# Altium schematic sheet Analog.SchDoc
size A4; SheetNumber: 2; SheetTotal: 7
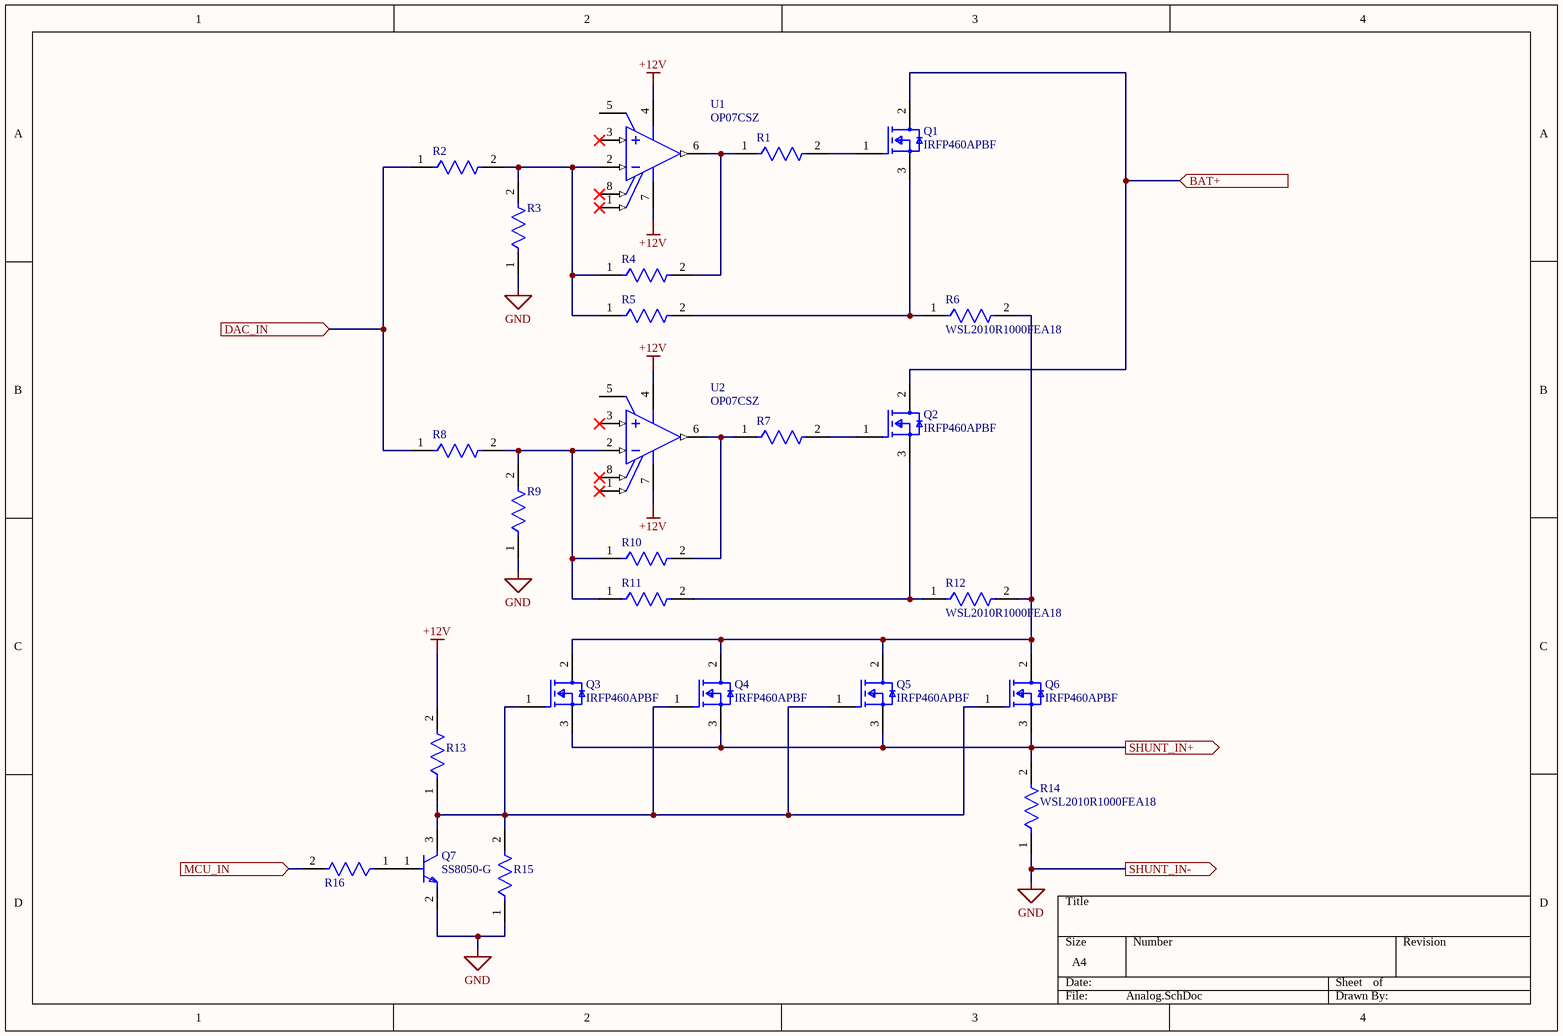
[diagram p0: Analog.SchDoc]

## Parts
Q1  IRFP460APBF  [FP-X13-0103-MFG]
Q2  IRFP460APBF  [FP-X13-0103-MFG]
Q3  IRFP460APBF  [FP-X13-0103-MFG]
Q4  IRFP460APBF  [FP-X13-0103-MFG]
Q5  IRFP460APBF  [FP-X13-0103-MFG]
Q6  IRFP460APBF  [FP-X13-0103-MFG]
Q7  SS8050-G  [FP-SS8050-G-MFG]
R1  ERJ-P06F1002V  [FP-ERJP06-MFG]  (value not drawn)
R2  ERJ-P06F1002V  [FP-ERJP06-MFG]  (value not drawn)
R3  ERJ-P06F1002V  [FP-ERJP06-MFG]  (value not drawn)
R4  ERJ-P06F1002V  [FP-ERJP06-MFG]  (value not drawn)
R5  ERJ-P06F1002V  [FP-ERJP06-MFG]  (value not drawn)
R6  WSL2010R1000FEA18  [FP-WSL2010-0_508-IPC_A]
R7  ERJ-P06F1002V  [FP-ERJP06-MFG]  (value not drawn)
R8  ERJ-P06F1002V  [FP-ERJP06-MFG]  (value not drawn)
R9  ERJ-P06F1002V  [FP-ERJP06-MFG]  (value not drawn)
R10  ERJ-P06F1002V  [FP-ERJP06-MFG]  (value not drawn)
R11  ERJ-P06F1002V  [FP-ERJP06-MFG]  (value not drawn)
R12  WSL2010R1000FEA18  [FP-WSL2010-0_508-IPC_A]
R13  ERJ-P06F1002V  [FP-ERJP06-MFG]  (value not drawn)
R14  WSL2010R1000FEA18  [FP-WSL2010-0_508-IPC_A]
R15  ERJ-P06F1002V  [FP-ERJP06-MFG]  (value not drawn)
R16  ERJ-P06F1002V  [FP-ERJP06-MFG]  (value not drawn)
U1  OP07CSZ  [ADI-R-8_M]
U2  OP07CSZ  [ADI-R-8_M]

## Ports
BAT+ (in, see Main[4B]), DAC_IN (in, see Main[3B]), MCU_IN (in, see Main[3B]), SHUNT_IN+ (out, see Main[4C], Sense Amplifier[1C]), SHUNT_IN- (out, see Main[4C], Sense Amplifier[1C])

## Nets
+12V: R13.2 U1.4(-V) U1.7(+V) U2.4(-V) U2.7(+V)
GND: Q7.2(E) R3.1 R9.1 R14.1 R15.1 ; port SHUNT_IN-
BAT+: Q1.2(D) Q2.2(D) ; port BAT+
DAC_IN: R2.1 R8.1 ; port DAC_IN
MCU_IN: R16.2 ; port MCU_IN
SHUNT_IN+: Q3.3(S) Q4.3(S) Q5.3(S) Q6.3(S) R14.2 ; port SHUNT_IN+
NetQ1_1: Q1.1(G) R1.2
NetQ1_3: Q1.3(S) R5.2 R6.1
NetQ2_1: Q2.1(G) R7.2
NetQ2_3: Q2.3(S) R11.2 R12.1
NetQ3_1: Q3.1(G) Q4.1(G) Q5.1(G) Q6.1(G) Q7.3(C) R13.1 R15.2
NetQ3_2: Q3.2(D) Q4.2(D) Q5.2(D) Q6.2(D) R6.2 R12.2
NetQ7_1: Q7.1(B) R16.1
NetR1_1: R1.1 R4.2 U1.6(OUT)
NetR2_2: R2.2 R3.2 R4.1 R5.1 U1.2(-IN)
NetR7_1: R7.1 R10.2 U2.6(OUT)
NetR8_2: R8.2 R9.2 R10.1 R11.1 U2.2(-IN)

Not connected (* = marked no-connect by the designer): U1 1(VOS_TRIM)* 3(+IN)* 5(NC) 8(VOS_TRIM)*; U2 1(VOS_TRIM)* 3(+IN)* 5(NC) 8(VOS_TRIM)*

## Library data of the parts
Q1-Q6 = CMP-02550-000181-1: MOSFET N-CH 500V 20A TO-247AC; Manufacturer: Vishay; Max Junction Temp: +150°C; Depletion Mode: False; Number Of N Channels: 1; Drain To Source Resistance: 0.27Ω; Input Capacitace At Vds: 3100pF @ 25V; Pulse Drain Current: 80A; Turn Off Delay Time: 45ns; Reverse Recovery Charge: 5000nC; Turn On Delay Time: 18ns; Reverse Recovery Time: 480ns; Gate Charge At Vgs: 105nC @ 10V; Rthja Max: 40°C/W; Threshold Vgs Max: 4V; Max Forward Diode Voltage: 1.8V; Standoff Height: 3.71mm; Gate To Source Voltage: 30V; Power Dissipation: 280W; Threshold Vgs Min: 2V; RoHS: TRUE; Package: X13-0103; Temperature: -55°C to +150°C; ComponentLink2Description: Datasheet; Device Class L1: Discrete Semiconductors; Temperature Range High: +150°C; ComponentLink2URL: http://www.vishay.com/docs/91234/sihfp460.pdf; Height: 25.11mm; Manufacturer Part Number: IRFP460APBF; Automotive: No; Device Class L2: Transistors; Continuous Drain Current: 20A; Octopart: https://octopart.com/irfp460apbf-vishay-46526673; Temperature Range Low: -55°C; Number Of Channels: 1; Drain To Source Breakdown Voltage: 500V; Mouser Description: MOSFET N-Chan 500V 20 Amp; Category: Trans; Drain To Source Voltage: 500V; Lead Free: Yes; Device Class L3: MOSFETs; Digikey Description: MOSFET N-CH 500V 20A TO-247AC
Q7 = CMP-20235-000001-1: NPN TRANSISTOR 1.5A 40V SOT-23 R; Transition Frequency: 100MHz; Max Breakdown Voltage: 25V; Collector Emitter Voltage (VCEO): 400mV; Max Power Dissipation: 300mW; Max Collector Current: 1.5A; Case/Package: TO-236-3; Packaging: Tape and Reel; RoHS Compliant: Yes; Mount: Surface Mount; Collector Emitter Breakdown Voltage: 25V
R1-R5 R7-R11 R13 R15 R16 = CMP-05422-000126-1: RES SMD 10K OHM 1% 1/2W 0805; Temperature Coefficient: 100ppm/°C; Resistance: 10kR; Voltage Rating (DC): 150V; Max Power Dissipation: 500mW; Termination: SMD/SMT; Tolerance: 1%; Width: 1.2mm; Case/Package: 0805; Number of Terminations: 2; Resistor Type: Thick Film; Radiation Hardening: No; Resistance Tolerance: 1%; Package Quantity: 5000; Max Operating Temperature: 155°C; RoHS Compliant: Yes; Mount: Surface Mount; Case Code (Imperial): 0805; Construction: Rectangular; Height: 0.6mm; Lead Free: Lead Free; Depth: 1.25mm; Packaging: Tape and Reel; REACH SVHC: No SVHC; Technology: THICK FILM; Features: Automotive AEC-Q200; Contact Plating: Tin; Voltage Rating: 150V; Military Standard: Not; Power Rating: 500mW; Case Code (Metric): 2012; Length: 2mm; Min Operating Temperature: -55°C; Series: ERJ
R6 R12 R14 = CMP-00030-39744249-1: WSL2010R1000FEA18 SMD Chip Resistor, 100 MOhm, ± 1%, 1 W, 2010 [5025 Metric], Metal Strip, High Power; Resistance: 100mΩ; Power Rating: 1W; Temperature Coefficient: 75ppm/°C; Packaging: Cut Tape; Schedule B: 8533210045, 8533210045; Contact Plating: Tin; Height: 635µm; Max Operating Temperature: 170°C; Lead Free: Lead Free; RoHS: Compliant; Width: 2.5mm; Composition: Metal Element, Metal Strip; Radiation Hardening: No; Termination: SMD/SMT; Depth: 2.54mm; Length: 5mm; Case Code (Imperial): 2010; Case Code (Metric): 5025; Case/Package: 2010; Weight: 38.895546mg; REACH SVHC: Unknown; NexarPartId: 39744249; Tolerance: 1%; Min Operating Temperature: -65°C; Number of Pins: 2
U1 U2 = CMP-0384-01158-1: Single Channel Low Noise Operational Amplifier, 600 KHz BW, 300 mV/us SR, Industrial, 8-pin SOIC (R-8), Tube; Manufacturer: Analog Devices; Generic Part Number: OP07; # OpAmps per Pkg: 1; V Span Max: 44V; V Span Min: 6V; Small Signal Bandwidth: 600KHz; PackageReference: R-8; Packing: Tube; ComponentLink3Description: Package Specification; PartNumber: OP07CSZ; Code_JEDEC: MS-012-AA; ComponentLink2Description: Datasheet; DatasheetVersion: Rev. G; ComponentLink3URL: http://www.analog.com/static/imported-files/packages/PKG_PDF/SOIC_Narrow%20(R)/R_8.pdf; ComponentLink2URL: http://www.analog.com/static/imported-files/data_sheets/OP07.pdf; Slew Rate: 300mV/us; PackageDescription: 8-Pin Standard Small Outline Package, Body 3.9 x 4.9 mm, Pitch 1.27 mm; ComponentLink1URL: http://www.analog.com/en/index.html; Mounting Technology: Surface Mount; ComponentLink1Description: Manufacturer URL; PackageVersion: 060506-A